# EAGLE design RGB_Taster_WS2811 (EAGLE 9.6.2)
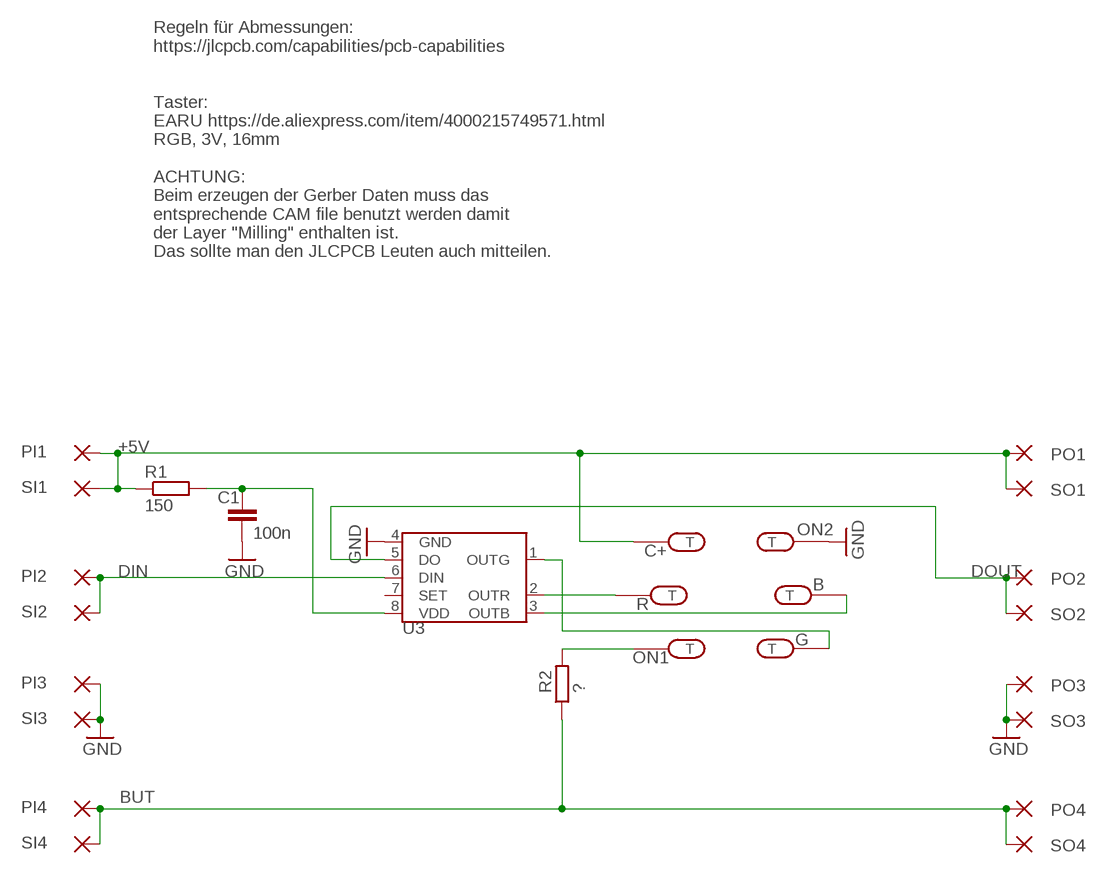
[diagram p0: schematic, sheet 1]

## Parts
B  LANG_LOCH2  [LANG_LOCH2]
C1  100n  C-EUC0603  [C0603]
C+  LANG_LOCH2  [LANG_LOCH2]
G  LANG_LOCH2  [LANG_LOCH2]
ON1  LANG_LOCH2  [LANG_LOCH2]
ON2  LANG_LOCH2  [LANG_LOCH2]
PI1  SMD2  [SMD1,27-2,54]
PI2  SMD2  [SMD1,27-2,54]
PI3  SMD2  [SMD1,27-2,54]
PI4  SMD2  [SMD1,27-2,54]
PO1  SMD2  [SMD1,27-2,54]
PO2  SMD2  [SMD1,27-2,54]
PO3  SMD2  [SMD1,27-2,54]
PO4  SMD2  [SMD1,27-2,54]
R  LANG_LOCH2  [LANG_LOCH2]
R1  150  RCL_R-EU_R0603  [RCL_R0603]
R2  ?  RCL_R-EU_R0603  [RCL_R0603]
SI1  SMD2  [SMD1,27-2,54]
SI2  SMD2  [SMD1,27-2,54]
SI3  SMD2  [SMD1,27-2,54]
SI4  SMD2  [SMD1,27-2,54]
SO1  SMD2  [SMD1,27-2,54]
SO2  SMD2  [SMD1,27-2,54]
SO3  SMD2  [SMD1,27-2,54]
SO4  SMD2  [SMD1,27-2,54]
U3  WS2811  S3PO_MODUL_WS2811_SOUND_MP3-TF-16P_WS2811_AND_ATTINY_WS2811-ICSOP8  [SOP8]

## Nets
+5V: C+.P$1(T) C+.P$2(T) PI1.1(P) PO1.1(P) R1.1 SI1.1(P) SO1.1(P)
BUT: PI4.1(P) PO4.1(P) R2.1 SI4.1(P) SO4.1(P)
DIN: PI2.1(P) SI2.1(P) U3.6(DIN)
DOUT: PO2.1(P) SO2.1(P) U3.5(DO)
GND: C1.2 ON2.P$1(T) ON2.P$2(T) PI3.1(P) PO3.1(P) SI3.1(P) SO3.1(P) U3.4(GND)
N$2: B.P$1(T) B.P$2(T) U3.3(OUTB)
N$3: R.P$1(T) R.P$2(T) U3.2(OUTR)
N$4: C1.1 R1.2 U3.8(VDD)
N$5: G.P$1(T) G.P$2(T) U3.1(OUTG)
N$6: ON1.P$1(T) ON1.P$2(T) R2.2
Unconnected: U3.7(SET)

## Notes on the sheet
- Regeln für Abmessungen:
  https://jlcpcb.com/capabilities/pcb-capabilities
  
  
  Taster:
  EARU https://de.aliexpress.com/item/4000215749571.html
  RGB, 3V, 16mm
  
  ACHTUNG:
  Beim erzeugen der Gerber Daten muss das
  entsprechende CAM file benutzt werden damit 
  der Layer "Milling" enthalten ist.
  Das sollte man den JLCPCB Leuten auch mitteilen.

## Library data of the parts
B C+ G ON1 ON2 R = RGB_Tast:LANG_LOCH
C1 = rcl:C-EU: CAPACITOR, European symbol; SPICEPREFIX: C
PI1-PI4 PO1-PO4 SI1-SI4 SO1-SO4 = wirepad:SMD2: SMD PAD
R1 R2 = Sound_MP3-TF-16P_and_WS2811:RCL_R-EU_: RESISTOR, European symbol; SPICEPREFIX: R
U3 = S3PO_Modul_WS2811:S3PO_MODUL_WS2811_SOUND_MP3-TF-16P_WS2811_AND_ATTINY_WS2811-IC: Die Pin Nummern für R und G sind getauscht damit sie gleich angesteuert werden wie die WS2812. Der Daten Strom der WS2811 ist RGB, Beim WS2812 ist es aber GRB.

## Board
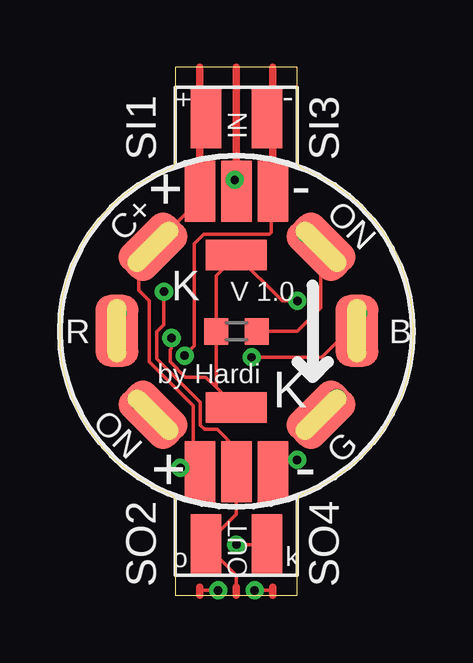
[diagram p1: board, top side]
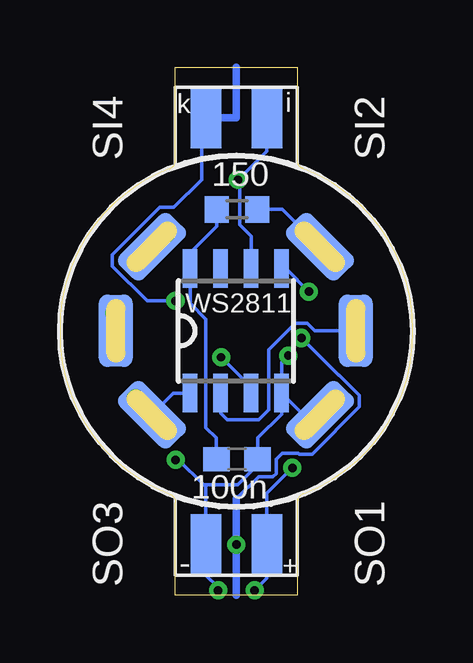
[diagram p2: board, bottom side, seen from below]

Size 14.7 x 22 mm. Coordinates in mm from the lower left corner, seen from the top.
Outline: 4.81,4.01 4.81,3.89
Outline: 4.81,3.89 4.81,0 9.89,0 9.89,3.89 arc-70 10.14,4.23 arc70 14.7,11.02 arc70 10.14,17.77 arc-75 9.89,18.11 9.89,22 4.81,22 4.81,18.11 arc-70 4.56,17.77 arc70 0,11.02 arc70 4.56,4.23 arc-70 4.81,3.89
Copper layers (1*16): Top 0.035mm / dielectric 1.5mm / Bottom 0.035mm
Design rules "default *": minimum track width 6mil, minimum drill 0.35mm, track to track 6mil, track to pad 6mil, pad to pad 6mil, via to via 6mil, smd to smd 6mil, copper to edge 40mil, drill to drill 6mil, minimum pad ring 10mil, minimum via ring 8mil, stop-mask expansion 4mil, vias tented up to drill 0.5mm, thermal gap 10mil

### Footprints (pad centres in the part's own frame; a part is rotated, then mirrored left to right if it is on the bottom)
LANG_LOCH2 = smd 3 x 1.8: P$1 0,0 | smd 3 x 1.4 bottom: P$2 0,0
C0603 = smd 1.1 x 1: 1 -0.85,0; 2 0.85,0
SMD1,27-2,54 = smd 1.27 x 2.54: 1 0,0
RCL_R0603 = smd 1 x 1.1: 1 -0.85,0; 2 0.85,0
SOP8 = smd 0.6 x 1.6: 1 -1.905,-2.6; 2 -0.635,-2.6; 3 0.635,-2.6; 4 1.905,-2.6; 5 1.905,2.6; 6 0.635,2.6; 7 -0.635,2.6; 8 -1.905,2.6

### Placement (x,y rotation side)
B  12.37,11.02 90 top
C1  7.33,5.67 0 bottom
C+  3.87,14.52 45 top
G  10.87,7.52 45 top
ON1  10.87,14.52 315 top
ON2  3.87,7.52 315 top
PI1  5.83,16.84 0 top
PI2  7.35,16.84 0 top
PI3  8.87,16.84 0 top
PI4  7.35,7.83 90 top
PO1  5.83,5.16 0 top
PO2  7.35,5.16 0 top
PO3  8.87,5.16 0 top
PO4  7.35,14.18 90 top
R  2.37,11.02 90 top
R1  7.33,16.08 180 bottom
R2  7.35,11 0 top
SI1  6.08,19.89 0 top
SI2  6.08,19.89 0 bottom
SI3  8.62,19.89 0 top
SI4  8.62,19.89 0 bottom
SO1  6.08,2.11 0 bottom
SO2  6.08,2.11 0 top
SO3  8.62,2.11 0 bottom
SO4  8.62,2.11 0 top
U3  7.37,11.02 0 bottom

### Tracks (layer width: path | path; a pad name or v marks a point on that pad's centre or on a via)
+5V  (via drill 0.35)
  Top 0.152: C+.P$2 3.29,13.94 v3.29,13.92 3.29,12.71 3.72,12.27 3.72,9.73 5.55,7.91 5.55,5.44 PO1.1 5.35,5.64 v5.02,5.31 | C+.P$2 5.83,16.48 PI1.1 | 3.57,14.22 C+.P$2 | 5.9,19.89 SI1.1 5.83,19.16 | 5.83,0.21 v6.59,0.21
  Top 0.305: PI1.1 5.83,19.16 5.83,22 | 5.83,0 5.83,0.21 5.83,0.33
  Bottom 0.152: R1.1 5.43,16.08 C+.P$2 3.29,13.94 v3.29,13.92 | v5.02,5.31 6.08,4.25 SO1.1 6.08,0.71 v6.59,0.21
BUT  (via drill 0.35)
  Top 0.152: 6.5,8.68 R2.1 6.5,13.33 PO4.1 9.26,12.27 v9.89,12.27 | 6.5,8.68 6.08,9.1 5.22,9.1 4.58,9.73 4.58,10.24 4.64,10.3 v4.64,10.72 | 6.5,8.68 PI4.1 | v7.35,2.11 SO4.1
  Bottom 0.152: 7.35,4.01 6.43,4.94 5.83,4.94 5.7,5.07 5.7,5.67 5.45,5.92 4.77,5.92 4.73,5.88 4.2,5.88 2.23,7.85 2.23,8.33 3.07,9.16 3.09,9.16 v4.64,10.72 | SI4.1 8.8,19.71 8.8,17.32 9.95,16.16 10.55,16.16 12.51,14.2 12.51,13.72 11.06,12.27 v9.89,12.27
  Bottom 0.305: 7.35,4.01 v7.35,2.11 7.35,0 | 7.35,22 7.35,19.89 SI4.1
DIN  (via drill 0.35)
  Top 0.152: PI2.1 7.28,16.91 v7.28,17.31
  Top 0.305: PI2.1 7.35,21.8 7.35,22
  Bottom 0.152: U3.6 6.74,14.97 7.21,15.44 7.21,17.23 v7.28,17.31 6.08,18.51 SI2.1
DOUT  (via drill 0.35)
  Top 0.152: v4.33,12.65 4.33,11.27 4.04,10.98 4.04,9.85 5.85,8.03 5.85,7.09 6.04,6.91 6.56,6.91 7.35,6.12 PO2.1 7.35,3.38 SO2.1 7.35,0.84 7.35,0.33
  Top 0.305: 7.35,0 7.35,0.33
  Bottom 0.152: v4.33,12.65 5.3,13.62 U3.5
GND  (via drill 0.35)
  Top 0.152: v3.29,8.08 3.38,8.08 ON2.P$2 | v5.19,9.98 5.6,10.39 5.6,14.65 5.99,15.04 8.72,15.04 8.81,15.13 8.81,16.78 PI3.1 9.28,16.84 9.44,16.68 | PO3.1 9.36,5.65 v9.88,5.65 | 8.8,19.89 SI3.1 8.87,19.47 | 8.87,0.21 v8.11,0.21
  Top 0.305: PI3.1 8.87,19.47 8.87,22 | 8.87,0.33 8.87,0.21 8.87,0
  Bottom 0.152: U3.4 5.47,7.55 6.45,6.57 C1.2 6.48,5.43 7.3,4.6 8.62,4.6 | U3.4 4.57,7.52 ON2.P$2 3.29,8.11 v3.29,8.08 | U3.4 5.47,9.71 v5.19,9.98 | v9.88,5.65 9.76,5.65 8.72,4.6 8.62,4.6 | v8.11,0.21 8.11,0.33 8.62,0.84 SO3.1 8.62,4.6
N$2  (via drill 0.35)
  Top 0.152: v12.43,11.76 12.37,11.71 B.P$2 12.01,11.02 10.91,9.92 v7.99,9.92
  Bottom 0.152: B.P$2 12.37,11.71 v12.43,11.76 | U3.3 6.74,8.67 v7.99,9.92
N$3  (via drill 0.35)
  Top 0.152: v2.4,11.76 2.4,11.05 R.P$2
  Bottom 0.152: v2.4,11.76 2.37,11.74 R.P$2 4.09,11.02 4.39,11.33 4.9,11.33 6,10.23 6,7.74 6.42,7.32 7.73,7.32 8.01,7.59 U3.2
N$4
  Bottom 0.152: R1.2 8.18,15.38 9.28,14.28 U3.8 9.28,12.17 8.62,11.51 8.62,6.99 8.19,6.56 C1.1
N$5  (via drill 0.35)
  Top 0.152: v11.54,8.21 11.54,8.19 G.P$2
  Bottom 0.152: U3.1 9.97,8.42 G.P$2 11.54,8.19 v11.54,8.21
N$6  (via drill 0.35)
  Top 0.152: v10.27,15.06 10.81,14.52 ON1.P$2 10.87,11.98 9.89,11 R2.2
  Bottom 0.152: ON1.P$2 10.33,15.06 v10.27,15.06

### Text on the board
tPlace: ON | C+ | R | B | G | ON
tNames: + | IN | - | + | - | K | V 1.0 | by Hardi | K | + | - | OUT | o | k
bNames: k | i | - | +
Document: Soll: / Messung: / Diagonal: 9.9 / Horizontal 10.0 / / Laut https://de.aliexpress.com/item/4000215749571.html / Diagonal: 10.1 / / To panalize copy with a grid of 22mm